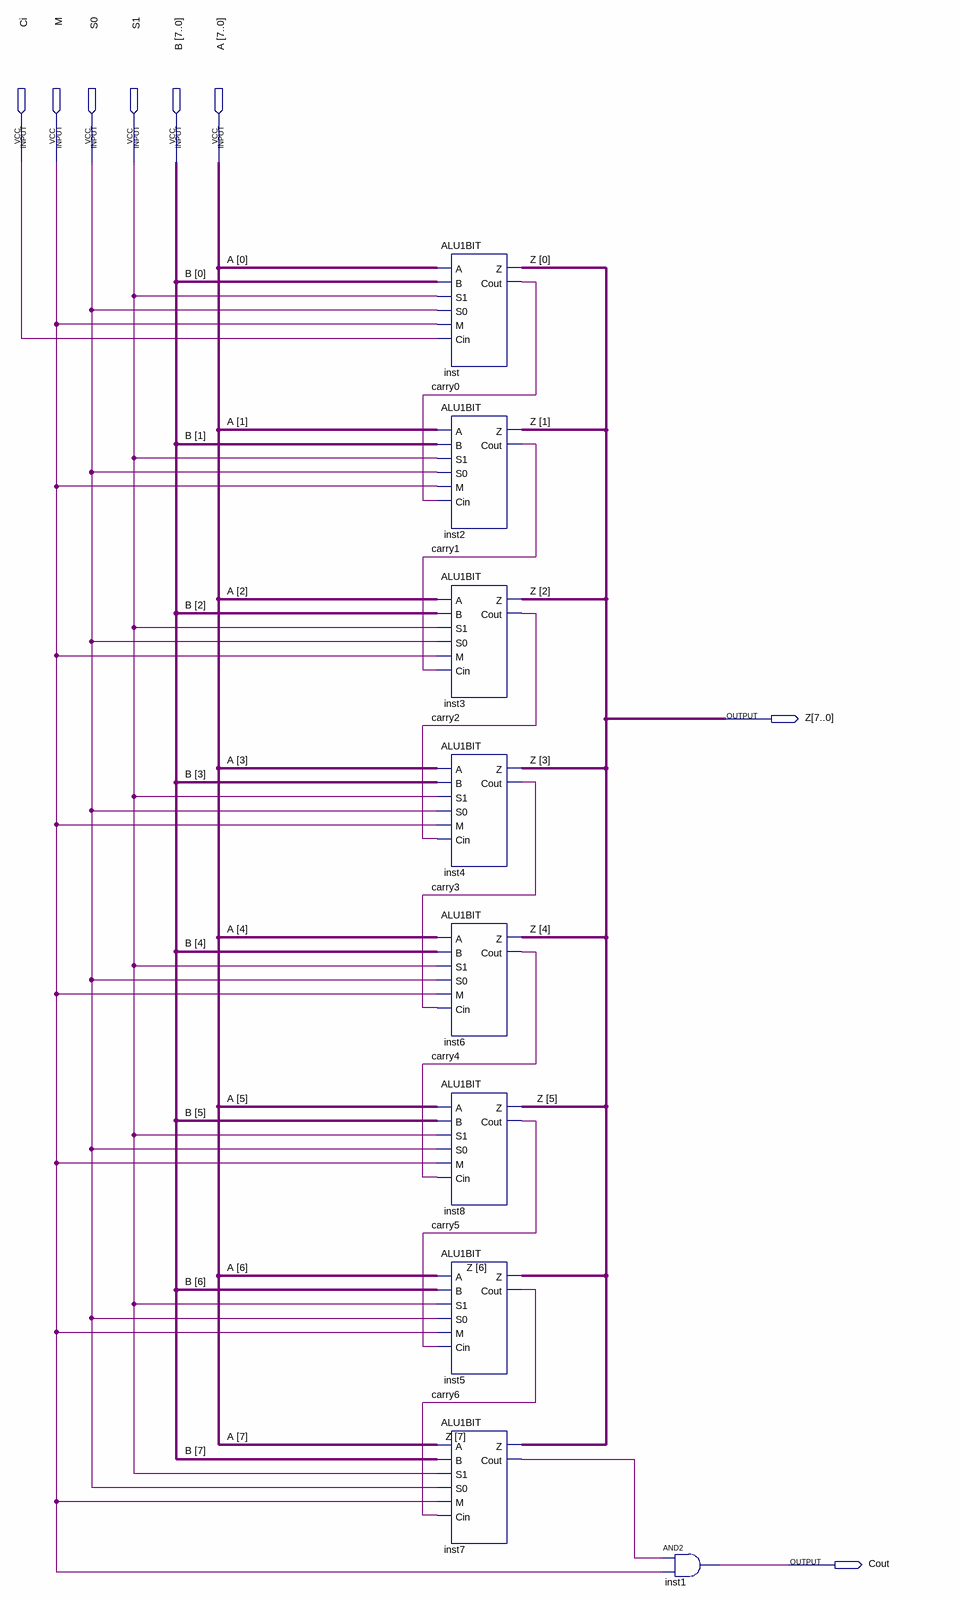
[diagram p0: schematic sheet]
// Quartus schematic ALU8BIT.bdf as structural Verilog: 9 symbols, 8 pins
module ALU8BIT (
  input  Ci,
  input  M,
  input  S0,
  input  S1,
  input  [7:0] B,
  input  [7:0] A,
  output [7:0] Z,
  output Cout
);

  wire carry0, carry1, carry2, carry3, carry4, carry5, carry6, inst7_cout;

  ALU1BIT inst (.A(A[0]), .B(B[0]), .S1(S1), .S0(S0), .M(M), .Cin(Ci), .Z(Z[0]), .Cout(carry0));
  ALU1BIT inst2 (.A(A[1]), .B(B[1]), .S1(S1), .S0(S0), .M(M), .Cin(carry0), .Z(Z[1]), .Cout(carry1));
  ALU1BIT inst3 (.A(A[2]), .B(B[2]), .S1(S1), .S0(S0), .M(M), .Cin(carry1), .Z(Z[2]), .Cout(carry2));
  ALU1BIT inst4 (.A(A[3]), .B(B[3]), .S1(S1), .S0(S0), .M(M), .Cin(carry2), .Z(Z[3]), .Cout(carry3));
  ALU1BIT inst6 (.A(A[4]), .B(B[4]), .S1(S1), .S0(S0), .M(M), .Cin(carry3), .Z(Z[4]), .Cout(carry4));
  ALU1BIT inst8 (.A(A[5]), .B(B[5]), .S1(S1), .S0(S0), .M(M), .Cin(carry4), .Z(Z[5]), .Cout(carry5));
  ALU1BIT inst5 (.A(A[6]), .B(B[6]), .S1(S1), .S0(S0), .M(M), .Cin(carry5), .Z(Z[6]), .Cout(carry6));
  ALU1BIT inst7 (.A(A[7]), .B(B[7]), .S1(S1), .S0(S0), .M(M), .Cin(carry6), .Z(Z[7]), .Cout(inst7_cout));
  and inst1 (Cout, inst7_cout, M);
endmodule
